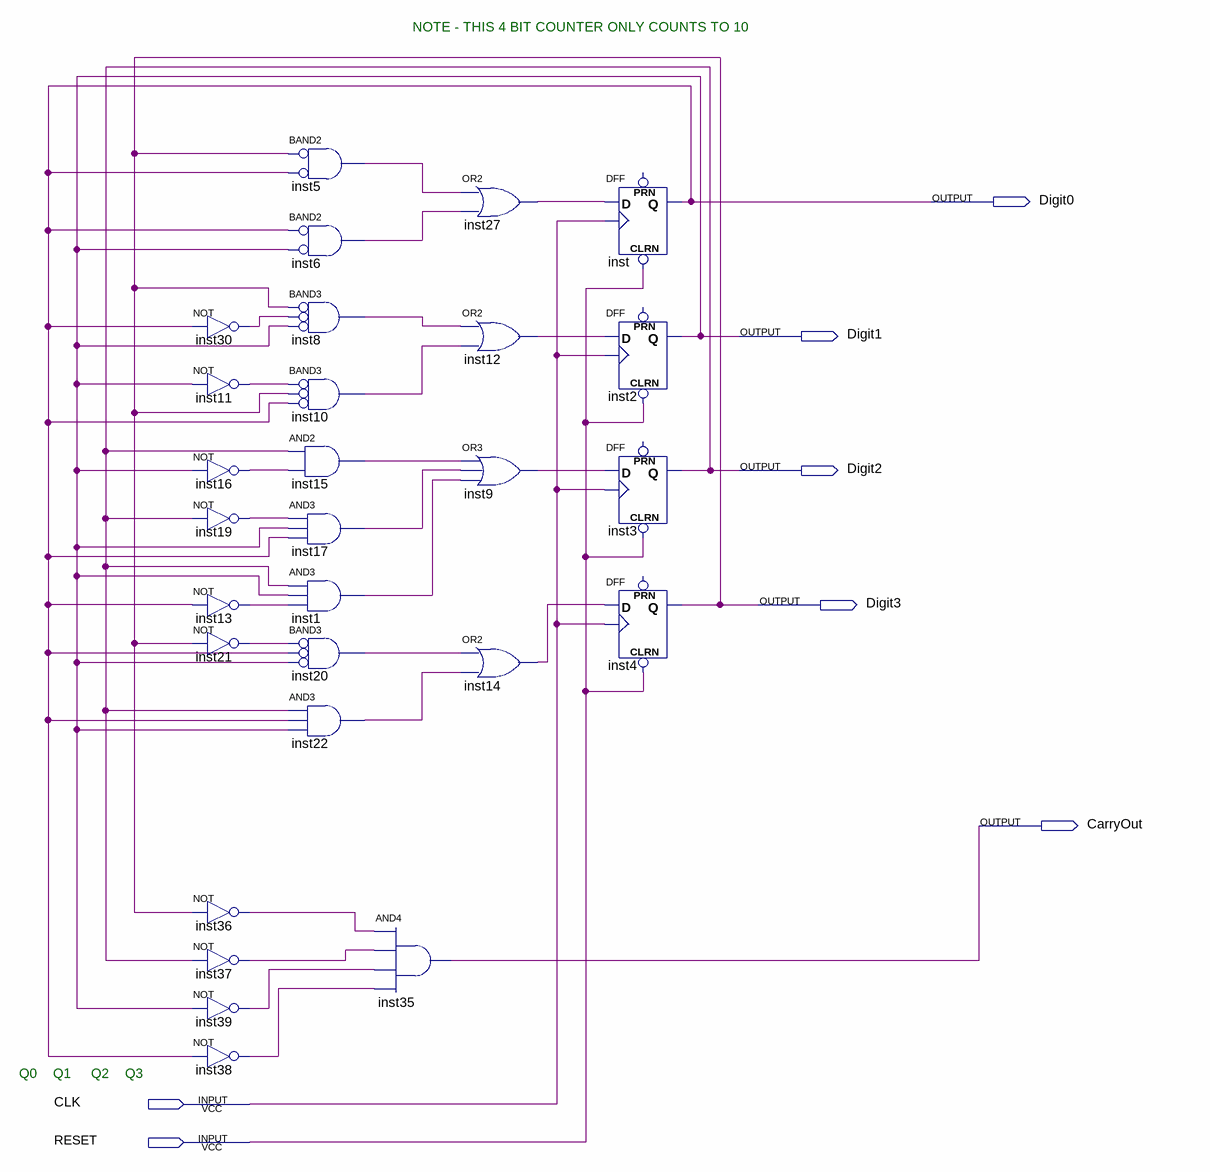
[diagram p0: schematic sheet]
// Quartus schematic BCDCounter4bitExpandable.bdf as structural Verilog: 28 symbols, 7 pins
module BCDCounter4bitExpandable (
  input  CLK,
  input  RESET,
  output Digit0,
  output Digit1,
  output Digit2,
  output Digit3,
  output CarryOut
);

  wire inst1_out, inst5_out, inst6_out, inst8_out, inst9_out, inst10_out, inst11_out, inst12_out, inst13_out,
       inst14_out, inst15_out, inst16_out, inst17_out, inst19_out, inst20_out, inst21_out, inst22_out,
       inst27_out, inst30_out, inst36_out, inst37_out, inst38_out, inst39_out;

  not inst30 (inst30_out, Digit0);
  not inst11 (inst11_out, Digit1);
  not inst16 (inst16_out, Digit1);
  not inst19 (inst19_out, Digit2);
  not inst13 (inst13_out, Digit0);
  not inst21 (inst21_out, Digit3);
  not inst36 (inst36_out, Digit3);
  not inst37 (inst37_out, Digit2);
  not inst39 (inst39_out, Digit1);
  not inst38 (inst38_out, Digit0);
  and inst5 (inst5_out, ~Digit3, ~Digit0);  // BAND2
  and inst6 (inst6_out, ~Digit0, ~Digit1);  // BAND2
  and inst8 (inst8_out, ~Digit3, ~inst30_out, ~Digit1);  // BAND3
  and inst10 (inst10_out, ~inst11_out, ~Digit3, ~Digit0);  // BAND3
  and inst15 (inst15_out, Digit2, inst16_out);
  and inst17 (inst17_out, inst19_out, Digit1, Digit0);
  and inst1 (inst1_out, Digit2, Digit1, inst13_out);
  and inst20 (inst20_out, ~inst21_out, ~Digit0, ~Digit1);  // BAND3
  and inst22 (inst22_out, Digit2, Digit0, Digit1);
  and inst35 (CarryOut, inst36_out, inst37_out, inst39_out, inst38_out);
  or inst27 (inst27_out, inst5_out, inst6_out);
  or inst12 (inst12_out, inst8_out, inst10_out);
  or inst9 (inst9_out, inst15_out, inst17_out, inst1_out);
  or inst14 (inst14_out, inst20_out, inst22_out);
  DFF inst (.CLRN(RESET), .CLK(CLK), .D(inst27_out), .Q(Digit0));  // open: PRN
  DFF inst2 (.CLRN(RESET), .CLK(CLK), .D(inst12_out), .Q(Digit1));  // open: PRN
  DFF inst3 (.CLRN(RESET), .CLK(CLK), .D(inst9_out), .Q(Digit2));  // open: PRN
  DFF inst4 (.CLRN(RESET), .CLK(CLK), .D(inst14_out), .Q(Digit3));  // open: PRN

  // Notes on the sheet:
  //   NOTE - THIS 4 BIT COUNTER ONLY COUNTS TO 10
  //   Q0    Q1     Q2    Q3
endmodule
